# Altium schematic sheet CSS135_continuity_board.SchDoc
size A
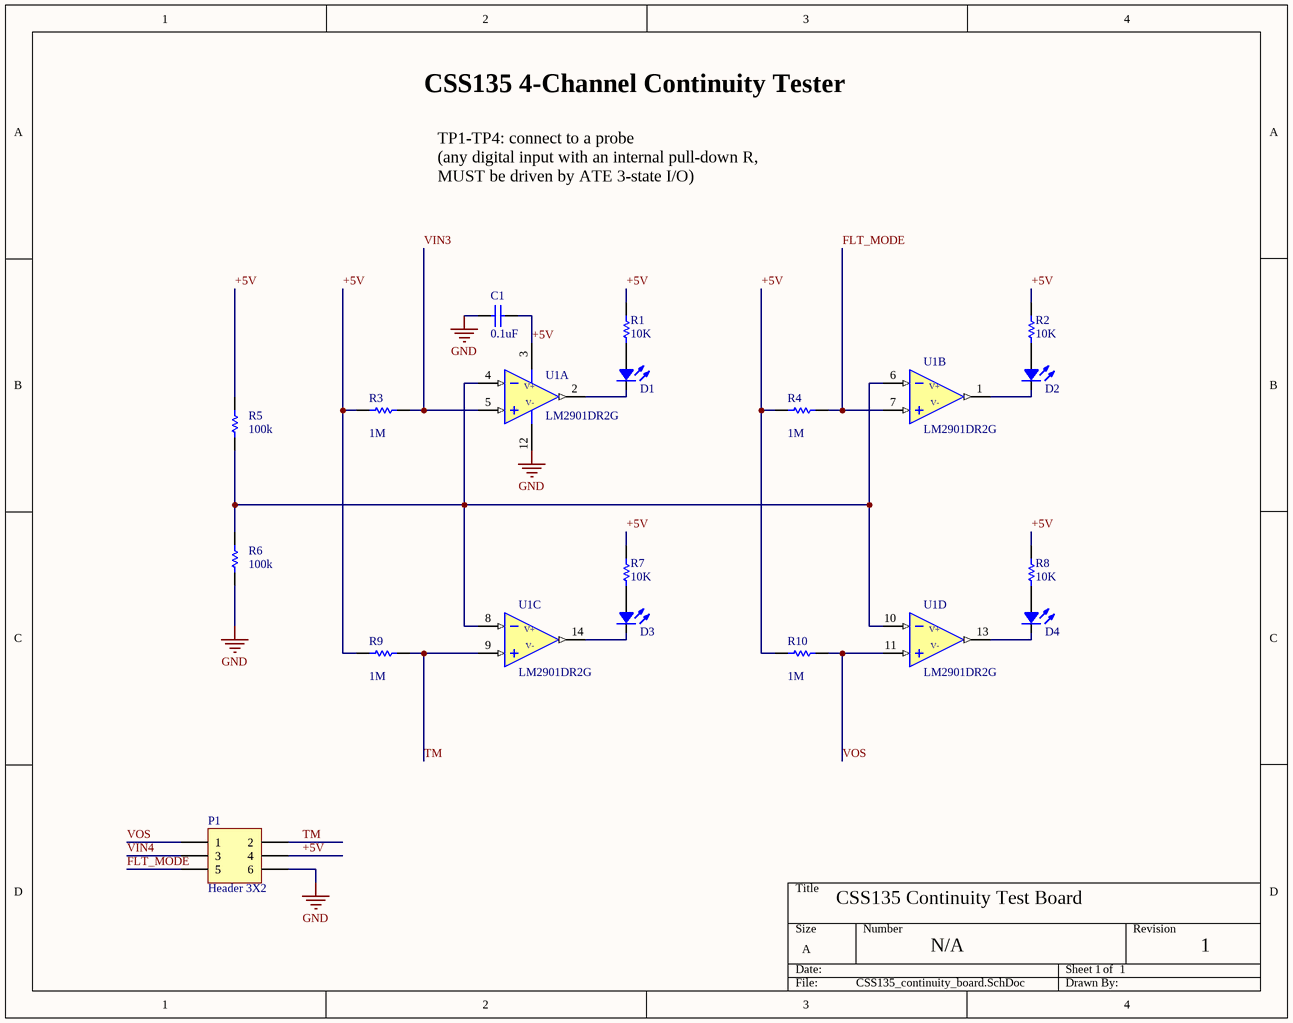
[diagram p0: CSS135_continuity_board.SchDoc]

## Parts
C1  value 0.1uF  [0805]  (hidden comment: Cap)
D1  LED green  [0805_d]  (value not drawn)
D2  LED green  [0805_d]  (value not drawn)
D3  LED green  [0805_d]  (value not drawn)
D4  LED green  [0805_d]  (value not drawn)
P1  Header 3X2  [HDR2X3]
R1  value 10K  [0603]  (hidden comment: Res1)
R2  value 10K  [0603]  (hidden comment: Res1)
R3  1M  [0805]
R4  1M  [0805]
R5  100k  [0805]
R6  100k  [0805]
R7  value 10K  [0603]  (hidden comment: Res1)
R8  value 10K  [0603]  (hidden comment: Res1)
R9  1M  [0805]
R10  1M  [0805]
U1  LM2901DR2G  [SOIC-14]  (parts A,B,C,D of 4)

## Nets
GND: C1.2 P1.6 R6.1 U1.12(-VS)
+5V: C1.1 P1.4 R1.2 R2.2 R3.2 R4.2 R5.2 R7.2 R8.2 R9.2 R10.2 U1.3(+VS)
FLT_MODE: P1.5 R4.1 U1.7(+IN)
TM: P1.2 R9.1 U1.9(+IN)
VIN3: R3.1 U1.5(+IN)
VIN4: P1.3
VOS: P1.1 R10.1 U1.11(+IN)
NetD1_1: D1.1(A) R1.1
NetD1_2: D1.2(K) U1.2(OUT)
NetD2_1: D2.1(A) R2.1
NetD2_2: D2.2(K) U1.1(OUT)
NetD3_1: D3.1(A) R7.1
NetD3_2: D3.2(K) U1.14(OUT)
NetD4_1: D4.1(A) R8.1
NetD4_2: D4.2(K) U1.13(OUT)
NetR5_1: R5.1 R6.2 U1.4(-IN) U1.6(-IN) U1.8(-IN) U1.10(-IN)

## Notes on the sheet
- CSS135 4-Channel Continuity Tester
- TP1-TP4: connect to a probe
  (any digital input with an internal pull-down R, MUST be driven by ATE 3-state I/O)
- CSS135 Continuity Test Board
- N/A
- 1
- (in symbol LM2901, part A) V+; V-
- (in symbol LM2901, part B) V+; V-
- (in symbol LM2901, part C) V+; V-
- (in symbol LM2901, part D) V+; V-

## Library data of the parts
C1 = Cap: CAP CER 0.1UF 50V X7R 0805; manufacturer: AVX Corp; manufacturer pn: 08055C104KAT2A; supplier: digikey; supplier pn: 478-1395-1-ND
D1-D4 = LED_b: LED GREEN CLEAR 0805 SMD; manufacturer: Wurth Electronics Inc; manufacturer pn: 150080GS75000; supplier: digikey; supplier pn: 732-4983-1-ND
P1 = Header 3X2: Header, 3-Pin, Dual row; LatestRevisionDate: 17-Jul-2002; LatestRevisionNote: Re-released for DXP Platform.; Publisher: Altium Limited
R1 R2 R7 R8 = Res1: RES SMD 10K OHM 1% 1/10W 0603; manufacturer: Yageo; manufacturer pn: RC0603FR-0710KL; supplier: digikey; supplier pn: 311-10.0KHRCT-ND
R3 R4 R9 R10 = Res1: RES 1M OHM 1% 1/8W 0805; manufacturer: Stackpole; manufacturer pn: RMCF0805FG1M00; supplier: digikey; supplier pn: RMCF0805FG1M00CT-ND; Value: 1M
R5 R6 = Res1: RES 100K OHM 1% 1/8W 0805; manufacturer: Stackpole; manufacturer pn: RMCF0805FG100K; supplier: digikey; supplier pn: RMCF0805FG100KCT-ND; Value: 100k
U1 = LM2901: IC COMP QUAD SGL SUPPLY 14SOIC; manufacturer: onsemi; supplier pn: LM2901DR2GOSCT-ND; supplier: digikey; manufacturer pn: LM2901DR2G